# Altium schematic sheet 04_iMX 8X_PWR.SchDoc
size A3; DrawnBy: Elio F; Engineer: Elio F; Revision: A; SheetNumber: 5; SheetTotal: 22; Sheet Title: Power Unit
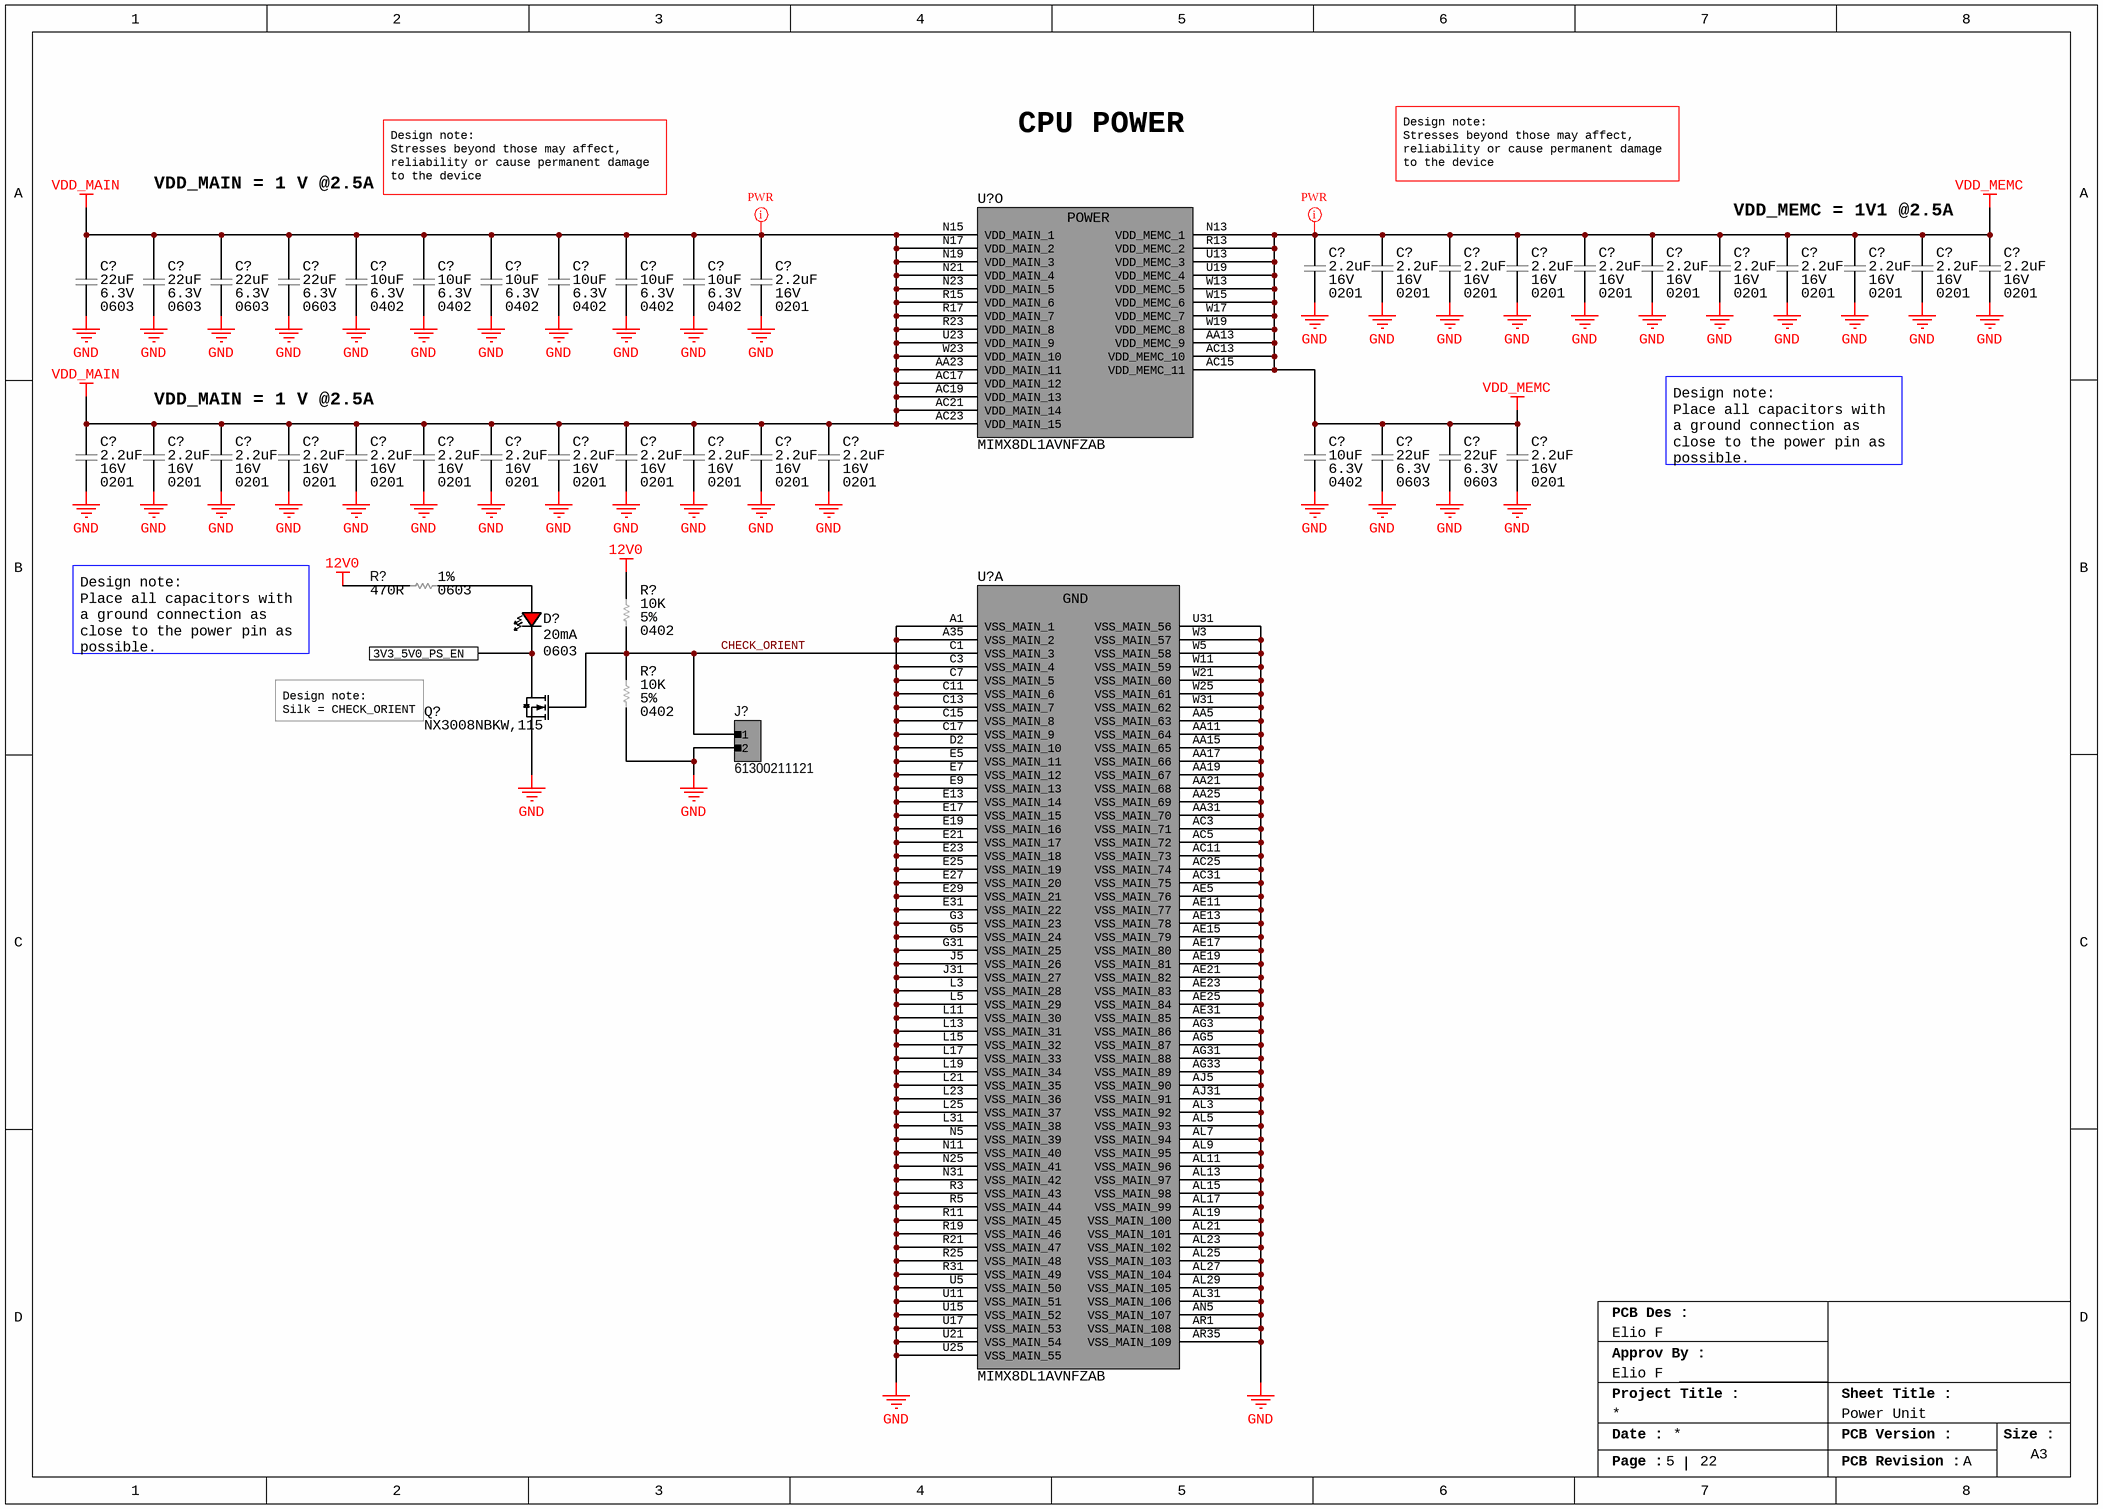
[diagram p0: 04_iMX 8X_PWR.SchDoc]

## Parts
(Parts that share a designator on the sheet are numbered #1, #2 ... from top to bottom, then left to right.)
C?#1  Capacitance: 2.2uF  Voltage Rating: 16V  Case/Package: 0201  [CAP_0201_CAPC0603X03N]  (hidden comment: GRM035R61C225ME01D)
C?#2  Capacitance: 2.2uF  Voltage Rating: 16V  Case/Package: 0201  [CAP_0201_CAPC0603X03N]  (hidden comment: GRM035R61C225ME01D)
C?#3  Capacitance: 2.2uF  Voltage Rating: 16V  Case/Package: 0201  [CAP_0201_CAPC0603X03N]  (hidden comment: GRM035R61C225ME01D)
C?#4  Capacitance: 2.2uF  Voltage Rating: 16V  Case/Package: 0201  [CAP_0201_CAPC0603X03N]  (hidden comment: GRM035R61C225ME01D)
C?#5  Capacitance: 2.2uF  Voltage Rating: 16V  Case/Package: 0201  [CAP_0201_CAPC0603X03N]  (hidden comment: GRM035R61C225ME01D)
C?#6  Capacitance: 2.2uF  Voltage Rating: 16V  Case/Package: 0201  [CAP_0201_CAPC0603X03N]  (hidden comment: GRM035R61C225ME01D)
C?#7  Capacitance: 2.2uF  Voltage Rating: 16V  Case/Package: 0201  [CAP_0201_CAPC0603X03N]  (hidden comment: GRM035R61C225ME01D)
C?#8  Capacitance: 2.2uF  Voltage Rating: 16V  Case/Package: 0201  [CAP_0201_CAPC0603X03N]  (hidden comment: GRM035R61C225ME01D)
C?#9  Capacitance: 2.2uF  Voltage Rating: 16V  Case/Package: 0201  [CAP_0201_CAPC0603X03N]  (hidden comment: GRM035R61C225ME01D)
C?#10  Capacitance: 2.2uF  Voltage Rating: 16V  Case/Package: 0201  [CAP_0201_CAPC0603X03N]  (hidden comment: GRM035R61C225ME01D)
C?#11  Capacitance: 2.2uF  Voltage Rating: 16V  Case/Package: 0201  [CAP_0201_CAPC0603X03N]  (hidden comment: GRM035R61C225ME01D)
C?#12  Voltage Rating: 6.3V  Capacitance: 22uF  Case/Package: 0603  [CAP_0603_CAPC1608X08N]  (hidden comment: GRM188R60J226MEA0D)
C?#13  Voltage Rating: 6.3V  Capacitance: 22uF  Case/Package: 0603  [CAP_0603_CAPC1608X08N]  (hidden comment: GRM188R60J226MEA0D)
C?#14  Voltage Rating: 6.3V  Capacitance: 22uF  Case/Package: 0603  [CAP_0603_CAPC1608X08N]  (hidden comment: GRM188R60J226MEA0D)
C?#15  Voltage Rating: 6.3V  Capacitance: 22uF  Case/Package: 0603  [CAP_0603_CAPC1608X08N]  (hidden comment: GRM188R60J226MEA0D)
C?#16  Case/Package: 0402  Capacitance: 10uF  Voltage Rating: 6.3V  [CAP_0402_CAPC1005X05N]  (hidden comment: CL05A106MQ5NUNC)
C?#17  Case/Package: 0402  Capacitance: 10uF  Voltage Rating: 6.3V  [CAP_0402_CAPC1005X05N]  (hidden comment: CL05A106MQ5NUNC)
C?#18  Case/Package: 0402  Capacitance: 10uF  Voltage Rating: 6.3V  [CAP_0402_CAPC1005X05N]  (hidden comment: CL05A106MQ5NUNC)
C?#19  Case/Package: 0402  Capacitance: 10uF  Voltage Rating: 6.3V  [CAP_0402_CAPC1005X05N]  (hidden comment: CL05A106MQ5NUNC)
C?#20  Case/Package: 0402  Capacitance: 10uF  Voltage Rating: 6.3V  [CAP_0402_CAPC1005X05N]  (hidden comment: CL05A106MQ5NUNC)
C?#21  Case/Package: 0402  Capacitance: 10uF  Voltage Rating: 6.3V  [CAP_0402_CAPC1005X05N]  (hidden comment: CL05A106MQ5NUNC)
C?#22  Capacitance: 2.2uF  Voltage Rating: 16V  Case/Package: 0201  [CAP_0201_CAPC0603X03N]  (hidden comment: GRM035R61C225ME01D)
C?#23  Capacitance: 2.2uF  Voltage Rating: 16V  Case/Package: 0201  [CAP_0201_CAPC0603X03N]  (hidden comment: GRM035R61C225ME01D)
C?#24  Capacitance: 2.2uF  Voltage Rating: 16V  Case/Package: 0201  [CAP_0201_CAPC0603X03N]  (hidden comment: GRM035R61C225ME01D)
C?#25  Capacitance: 2.2uF  Voltage Rating: 16V  Case/Package: 0201  [CAP_0201_CAPC0603X03N]  (hidden comment: GRM035R61C225ME01D)
C?#26  Capacitance: 2.2uF  Voltage Rating: 16V  Case/Package: 0201  [CAP_0201_CAPC0603X03N]  (hidden comment: GRM035R61C225ME01D)
C?#27  Capacitance: 2.2uF  Voltage Rating: 16V  Case/Package: 0201  [CAP_0201_CAPC0603X03N]  (hidden comment: GRM035R61C225ME01D)
C?#28  Capacitance: 2.2uF  Voltage Rating: 16V  Case/Package: 0201  [CAP_0201_CAPC0603X03N]  (hidden comment: GRM035R61C225ME01D)
C?#29  Capacitance: 2.2uF  Voltage Rating: 16V  Case/Package: 0201  [CAP_0201_CAPC0603X03N]  (hidden comment: GRM035R61C225ME01D)
C?#30  Capacitance: 2.2uF  Voltage Rating: 16V  Case/Package: 0201  [CAP_0201_CAPC0603X03N]  (hidden comment: GRM035R61C225ME01D)
C?#31  Capacitance: 2.2uF  Voltage Rating: 16V  Case/Package: 0201  [CAP_0201_CAPC0603X03N]  (hidden comment: GRM035R61C225ME01D)
C?#32  Capacitance: 2.2uF  Voltage Rating: 16V  Case/Package: 0201  [CAP_0201_CAPC0603X03N]  (hidden comment: GRM035R61C225ME01D)
C?#33  Capacitance: 2.2uF  Voltage Rating: 16V  Case/Package: 0201  [CAP_0201_CAPC0603X03N]  (hidden comment: GRM035R61C225ME01D)
C?#34  Capacitance: 2.2uF  Voltage Rating: 16V  Case/Package: 0201  [CAP_0201_CAPC0603X03N]  (hidden comment: GRM035R61C225ME01D)
C?#35  Case/Package: 0402  Capacitance: 10uF  Voltage Rating: 6.3V  [CAP_0402_CAPC1005X05N]  (hidden comment: CL05A106MQ5NUNC)
C?#36  Voltage Rating: 6.3V  Capacitance: 22uF  Case/Package: 0603  [CAP_0603_CAPC1608X08N]  (hidden comment: GRM188R60J226MEA0D)
C?#37  Voltage Rating: 6.3V  Capacitance: 22uF  Case/Package: 0603  [CAP_0603_CAPC1608X08N]  (hidden comment: GRM188R60J226MEA0D)
C?#38  Capacitance: 2.2uF  Voltage Rating: 16V  Case/Package: 0201  [CAP_0201_CAPC0603X03N]  (hidden comment: GRM035R61C225ME01D)
D?  Test Current: 20mA  Case/Package: 0603  [LED_0603-RED-0.75mm]  (hidden comment: LTST-C190KRKT)
J?  61300211121  [HEADER_MALE_HDRV2W110P0X254_1X2_508X254X854P]
Q?  NX3008NBKW,115  [TRANS_FET_SOT65P210X110-3N]
R?#1  Tolerance: 1%  Resistance: 470R  Case/Package: 0603  [RES_0603_RESC1608X04N]  (hidden comment: RC0603FR-07470RL)
R?#2  Tolerance: 5%  Resistance: 10K  Case/Package: 0402  [RES_0402_RESC1005X04N]  (hidden comment: ERJ-2GEJ103X)
R?#3  Tolerance: 5%  Resistance: 10K  Case/Package: 0402  [RES_0402_RESC1005X04N]  (hidden comment: ERJ-2GEJ103X)
U?#1  MIMX8DL1AVNFZAB  [MIMX8DL1AVNFZAB]  (part O of 15)
U?#2  MIMX8DL1AVNFZAB  [MIMX8DL1AVNFZAB]  (part A of 15)

## Ports
3V3_5V0_PS_EN

## Nets
12V0: R?#1.1 R?#2.1
GND: C?#1.1 C?#2.1 C?#3.1 C?#4.1 C?#5.1 C?#6.1 C?#7.1 C?#8.1 C?#9.1 C?#10.1 C?#11.1 C?#12.1 C?#13.1 C?#14.1 C?#15.1 C?#16.1 C?#17.1 C?#18.1 C?#19.1 C?#20.1 C?#21.1 C?#22.1 C?#23.1 C?#24.1 C?#25.1 C?#26.1 C?#27.1 C?#28.1 C?#29.1 C?#30.1 C?#31.1 C?#32.1 C?#33.1 C?#34.1 C?#35.1 C?#36.1 C?#37.1 C?#38.1 J?.2 Q?.S R?#3.2 U?#2.A1(VSS_MAIN_1) U?#2.A35(VSS_MAIN_2) U?#2.AA5(VSS_MAIN_63) U?#2.AA11(VSS_MAIN_64) U?#2.AA15(VSS_MAIN_65) U?#2.AA17(VSS_MAIN_66) U?#2.AA19(VSS_MAIN_67) U?#2.AA21(VSS_MAIN_68) U?#2.AA25(VSS_MAIN_69) U?#2.AA31(VSS_MAIN_70) U?#2.AC3(VSS_MAIN_71) U?#2.AC5(VSS_MAIN_72) U?#2.AC11(VSS_MAIN_73) U?#2.AC25(VSS_MAIN_74) U?#2.AC31(VSS_MAIN_75) U?#2.AE5(VSS_MAIN_76) U?#2.AE11(VSS_MAIN_77) U?#2.AE13(VSS_MAIN_78) U?#2.AE15(VSS_MAIN_79) U?#2.AE17(VSS_MAIN_80) U?#2.AE19(VSS_MAIN_81) U?#2.AE21(VSS_MAIN_82) U?#2.AE23(VSS_MAIN_83) U?#2.AE25(VSS_MAIN_84) U?#2.AE31(VSS_MAIN_85) U?#2.AG3(VSS_MAIN_86) U?#2.AG5(VSS_MAIN_87) U?#2.AG31(VSS_MAIN_88) U?#2.AG33(VSS_MAIN_89) U?#2.AJ5(VSS_MAIN_90) U?#2.AJ31(VSS_MAIN_91) U?#2.AL3(VSS_MAIN_92) U?#2.AL5(VSS_MAIN_93) U?#2.AL7(VSS_MAIN_94) U?#2.AL9(VSS_MAIN_95) U?#2.AL11(VSS_MAIN_96) U?#2.AL13(VSS_MAIN_97) U?#2.AL15(VSS_MAIN_98) U?#2.AL17(VSS_MAIN_99) U?#2.AL19(VSS_MAIN_100) U?#2.AL21(VSS_MAIN_101) U?#2.AL23(VSS_MAIN_102) U?#2.AL25(VSS_MAIN_103) U?#2.AL27(VSS_MAIN_104) U?#2.AL29(VSS_MAIN_105) U?#2.AL31(VSS_MAIN_106) U?#2.AN5(VSS_MAIN_107) U?#2.AR1(VSS_MAIN_108) U?#2.AR35(VSS_MAIN_109) U?#2.C3(VSS_MAIN_4) U?#2.C7(VSS_MAIN_5) U?#2.C11(VSS_MAIN_6) U?#2.C13(VSS_MAIN_7) U?#2.C15(VSS_MAIN_8) U?#2.C17(VSS_MAIN_9) U?#2.D2(VSS_MAIN_10) U?#2.E5(VSS_MAIN_11) U?#2.E7(VSS_MAIN_12) U?#2.E9(VSS_MAIN_13) U?#2.E13(VSS_MAIN_14) U?#2.E17(VSS_MAIN_15) U?#2.E19(VSS_MAIN_16) U?#2.E21(VSS_MAIN_17) U?#2.E23(VSS_MAIN_18) U?#2.E25(VSS_MAIN_19) U?#2.E27(VSS_MAIN_20) U?#2.E29(VSS_MAIN_21) U?#2.E31(VSS_MAIN_22) U?#2.G3(VSS_MAIN_23) U?#2.G5(VSS_MAIN_24) U?#2.G31(VSS_MAIN_25) U?#2.J5(VSS_MAIN_26) U?#2.J31(VSS_MAIN_27) U?#2.L3(VSS_MAIN_28) U?#2.L5(VSS_MAIN_29) U?#2.L11(VSS_MAIN_30) U?#2.L13(VSS_MAIN_31) U?#2.L15(VSS_MAIN_32) U?#2.L17(VSS_MAIN_33) U?#2.L19(VSS_MAIN_34) U?#2.L21(VSS_MAIN_35) U?#2.L23(VSS_MAIN_36) U?#2.L25(VSS_MAIN_37) U?#2.L31(VSS_MAIN_38) U?#2.N5(VSS_MAIN_39) U?#2.N11(VSS_MAIN_40) U?#2.N25(VSS_MAIN_41) U?#2.N31(VSS_MAIN_42) U?#2.R3(VSS_MAIN_43) U?#2.R5(VSS_MAIN_44) U?#2.R11(VSS_MAIN_45) U?#2.R19(VSS_MAIN_46) U?#2.R21(VSS_MAIN_47) U?#2.R25(VSS_MAIN_48) U?#2.R31(VSS_MAIN_49) U?#2.U5(VSS_MAIN_50) U?#2.U11(VSS_MAIN_51) U?#2.U15(VSS_MAIN_52) U?#2.U17(VSS_MAIN_53) U?#2.U21(VSS_MAIN_54) U?#2.U25(VSS_MAIN_55) U?#2.U31(VSS_MAIN_56) U?#2.W3(VSS_MAIN_57) U?#2.W5(VSS_MAIN_58) U?#2.W11(VSS_MAIN_59) U?#2.W21(VSS_MAIN_60) U?#2.W25(VSS_MAIN_61) U?#2.W31(VSS_MAIN_62)
VDD_MAIN: C?#12.2 C?#13.2 C?#14.2 C?#15.2 C?#16.2 C?#17.2 C?#18.2 C?#19.2 C?#20.2 C?#21.2 C?#22.2 C?#23.2 C?#24.2 C?#25.2 C?#26.2 C?#27.2 C?#28.2 C?#29.2 C?#30.2 C?#31.2 C?#32.2 C?#33.2 C?#34.2 U?#1.AA23(VDD_MAIN_11) U?#1.AC17(VDD_MAIN_12) U?#1.AC19(VDD_MAIN_13) U?#1.AC21(VDD_MAIN_14) U?#1.AC23(VDD_MAIN_15) U?#1.N15(VDD_MAIN_1) U?#1.N17(VDD_MAIN_2) U?#1.N19(VDD_MAIN_3) U?#1.N21(VDD_MAIN_4) U?#1.N23(VDD_MAIN_5) U?#1.R15(VDD_MAIN_6) U?#1.R17(VDD_MAIN_7) U?#1.R23(VDD_MAIN_8) U?#1.U23(VDD_MAIN_9) U?#1.W23(VDD_MAIN_10)
VDD_MEMC: C?#1.2 C?#2.2 C?#3.2 C?#4.2 C?#5.2 C?#6.2 C?#7.2 C?#8.2 C?#9.2 C?#10.2 C?#11.2 C?#35.2 C?#36.2 C?#37.2 C?#38.2 U?#1.AA13(VDD_MEMC_9) U?#1.AC13(VDD_MEMC_10) U?#1.AC15(VDD_MEMC_11) U?#1.N13(VDD_MEMC_1) U?#1.R13(VDD_MEMC_2) U?#1.U13(VDD_MEMC_3) U?#1.U19(VDD_MEMC_4) U?#1.W13(VDD_MEMC_5) U?#1.W15(VDD_MEMC_6) U?#1.W17(VDD_MEMC_7) U?#1.W19(VDD_MEMC_8)
3V3_5V0_PS_EN: D?.1(C) Q?.D ; port 3V3_5V0_PS_EN
CHECK_ORIENT: J?.1 Q?.G R?#2.2 R?#3.1 U?#2.C1(VSS_MAIN_3)
NetD?_2: D?.2(A) R?#1.2

## Layout directives
net class PWR: VDD_MAIN, VDD_MEMC

## Notes on the sheet
- CPU POWER
- Design note:
  Stresses beyond those may affect, reliability or cause permanent damage to the device
- VDD_MAIN = 1 V @2.5A
- (near C?#8) VDD_MEMC = 1V1 @2.5A
- (near C?#24) VDD_MAIN = 1 V @2.5A
- Design note:
  Place all capacitors with a ground connection as close to the power pin as possible.
- Design note:
  Silk = CHECK_ORIENT
- PCB Des :
- Approv By :
- Project Title :
- Sheet Title :
- Date :
- PCB Version :
- Size :
- A3
- Page :
- PCB Revision :
- (in symbol IC_MPU_ARM_1.2GHz_MIMX8DL1AVNFZAB, part A) GND
- (in symbol IC_MPU_ARM_1.2GHz_MIMX8DL1AVNFZAB, part O) POWER

## Library data of the parts
C?#1-C?#11 C?#22-C?#34 C?#38 = CAP_2.2uF_16V_X5R_0201: General Up to 85C Reflow soldering; Manufacturer: Murata; Material: Ceramic; Dielectric: X5R; Tolerance: 20%; Supplier 1: Digikey; Manufacturer Part Number: GRM035R61C225ME01D; RoHS: No; Category: Ceramic Capacitors; Stock 1: 18674; Pricing 1: 1=0.36, 10=0.233, 50=0.1636, 100=0.1321, 500=0.09814, 1000=0.08587, 2500=0.08178, 5000=0.07565 (USD); Min Operating Temperature: -55°C; Max Operating Temperature: 85°C; Voltage Rating (DC): 16V; Length: 600um; Width: 300um; Height: 550um; Thickness: 500um; RoHS Compliant: Yes; ComponentLink1URL: https://datasheet.octopart.com/GRM035R61C225ME01D-Murata-datasheet-165579666.pdf?src-supplier=TME; ComponentLink1Description: https://datasheet.octopart.com/GRM035R61C225ME01D-Murata-datasheet-165579666.pdf?src-supplier=TME; Supplier Part Number 1: 490-GRM035R61C225ME01DCT-ND
C?#12-C?#15 C?#36 C?#37 = CAP_22uF_6.3V_X5R_0603: Multilayer Ceramic Capacitor, 22 uF, 6.3 V, ï¿½ 20%, X5R, 0603 [1608 Metric]; Manufacturer: Murata; Supplier 1: Digikey; Manufacturer Part Number: GRM188R60J226MEA0D; RoHS: Yes; Category: Ceramic Capacitors; Stock 1: 4736669; Pricing 1: 1=0.2, 10=0.113, 50=0.0794, 100=0.069, 500=0.05144, 1000=0.04599 (USD); Mount: Surface Mount; Number of Pins: 2; Case Code (Metric): 1608; Case Code (Imperial): 0603; Weight: 0.000222oz; Material: Ceramic; Min Operating Temperature: -55°C; Max Operating Temperature: 85°C; Packaging: Tape and Reel; Package Quantity: 1; Series: GRM; Tolerance: 20%; Dielectric: X5R; Termination: SMD/SMT; Voltage Rating (DC): 6.3V; Length: 0.063inch; Width: 0.031inch; Height: 0.8mm; Thickness: 0.039inch; Lead Free: Lead Free; RoHS Compliant: Yes; Reach SVHC Compliant: No; ComponentLink1URL: https://datasheet.ciiva.com/29540/partnumbering-e-01-29540441.pdf?src-supplier=Digikey; ComponentLink1Description: https://datasheet.ciiva.com/29540/partnumbering-e-01-29540441.pdf?src-supplier=Digikey; ComponentLink2URL: https://datasheet.ciiva.com/29540/partnumbering-e-01-29540442.pdf?src-supplier=Digikey; ComponentLink2Description: https://datasheet.ciiva.com/29540/partnumbering-e-01-29540442.pdf?src-supplier=Digikey; ComponentLink3URL: https://datasheet.ciiva.com/29540/partnumbering-e-01-29540443.pdf?src-supplier=Digikey; ComponentLink3Description: https://datasheet.ciiva.com/29540/partnumbering-e-01-29540443.pdf?src-supplier=Digikey; Supplier Part Number 1: 490-7611-1-ND
C?#16-C?#21 C?#35 = CAP_10UF_6.3V_X5R_0402: Cap Ceramic 10uF 6.3V X5R 20% SMD 0402 85C T/R; Manufacturer: Samsung; Supplier 1: Digikey; Manufacturer Part Number: CL05A106MQ5NUNC; RoHS: Yes; Category: Ceramic Capacitors; Stock 1: 6097180; Pricing 1: 1=0.24, 10=0.153, 50=0.0968, 100=0.0774, 500=0.05588, 1000=0.04943, 2500=0.04728, 5000=0.04299 (USD); Mount: Surface Mount; Case Code (Metric): 1005; Case Code (Imperial): 0402; Min Operating Temperature: -55°C; Max Operating Temperature: 85°C; Packaging: Tape and Reel; Tolerance: 20%; Dielectric: X5R; Series: CL; Package Quantity: 1; Construction: Flat; Length: 1mm; Width: 0.02inch; Height: 0.5mm; Depth: 0.5mm; Thickness: 0.028inch; Radiation Hardening: No; RoHS Compliant: Yes; ComponentLink1URL: https://datasheet.ciiva.com/16437/cl05a106mq5nunc-16437356.pdf?src-supplier=Future+Electronics; ComponentLink1Description: https://datasheet.ciiva.com/16437/cl05a106mq5nunc-16437356.pdf?src-supplier=Future+Electronics; ComponentLink2URL: https://datasheet.ciiva.com/26877/getdatasheetpartid-355289-26877841.pdf?src-supplier=Verical; ComponentLink2Description: https://datasheet.ciiva.com/26877/getdatasheetpartid-355289-26877841.pdf?src-supplier=Verical; Supplier Part Number 1: 1276-1451-1-ND
D? = LED_DIO_RED_20mA_0603: LED,  LTST-C190KRKT; Manufacturer: Vishay Lite-On; Color: Red; Lens Color: Colorless; Luminous Intensity: 54mcd; Viewing Angle: 130°; Lens Style: Diffused,Colorless,Clear,Rectangular; Power Rating: 75mW; Dominant Wavelength: 631nm; Lens Transparency: Clear; Number of Elements: 1; Wavelength: 639nm; Reverse Voltage: 5V; Forward Current: 30mA; Forward Voltage: 2.4V; Manufacturer Part Number: LTST-C190KRKT; RoHS: Yes; Category: LEDs; Stock 1: 712361; Pricing 1: 1=0.24000, 10=0.13200, 100=0.06110, 500=0.05640, 1000=0.04418, 2000=0.04324 (USD); Mount: Surface Mount; Number of Pins: 2; Case Code (Metric): 1608; Case Code (Imperial): 0603; Min Operating Temperature: -55°C; Max Operating Temperature: 85°C; Packaging: Tape and Reel; Package Quantity: 1; Illumination Color: Red; Power Dissipation: 75mW; Number of LEDs: 1; Length: 1.6mm; Width: 0.8mm; Height: 0.8mm; Depth: 0.8mm; Radiation Hardening: No; Lead Free: Lead Free; RoHS Compliant: Yes; ComponentLink1URL: https://datasheet.ciiva.com/19482/1260381-19482354.pdf?src-supplier=Jameco; ComponentLink1Description: https://datasheet.ciiva.com/19482/1260381-19482354.pdf?src-supplier=Jameco; ComponentLink2URL: https://datasheet.ciiva.com/12403/100-ltst-c190krkt-59805-12403895.pdf?src-supplier=Mouser; ComponentLink2Description: https://datasheet.ciiva.com/12403/100-ltst-c190krkt-59805-12403895.pdf?src-supplier=Mouser; ComponentLink3URL: https://datasheet.ciiva.com/16427/ltst-c190krkt-16427674.pdf?src-supplier=Future+Electronics; ComponentLink3Description: https://datasheet.ciiva.com/16427/ltst-c190krkt-16427674.pdf?src-supplier=Future+Electronics; ComponentLink4URL: https://datasheet.ciiva.com/15117/getdatasheetpartid-57395-15117240.pdf?src-supplier=Verical; ComponentLink4Description: https://datasheet.ciiva.com/15117/getdatasheetpartid-57395-15117240.pdf?src-supplier=Verical; ComponentLink5URL: https://datasheet.ciiva.com/11774/0900766b80dc02a9-11774043.pdf?src-supplier=Rs; ComponentLink5Description: https://datasheet.ciiva.com/11774/0900766b80dc02a9-11774043.pdf?src-supplier=Rs; ComponentLink6URL: https://datasheet.ciiva.com/2109/s-110-ltst-c190krkt-2109992.pdf?src-supplier=Digi-Key; ComponentLink6Description: https://datasheet.ciiva.com/2109/s-110-ltst-c190krkt-2109992.pdf?src-supplier=Digi-Key; ComponentLink7URL: https://datasheet.ciiva.com/2109/s-110-ltst-c190krkt-2109991.pdf?src-supplier=Digi-Key; ComponentLink7Description: https://datasheet.ciiva.com/2109/s-110-ltst-c190krkt-2109991.pdf?src-supplier=Digi-Key; ComponentLink8URL: https://datasheet.ciiva.com/2109/s-110-ltst-c190krkt-2109993.pdf?src-supplier=Digi-Key; ComponentLink8Description: https://datasheet.ciiva.com/2109/s-110-ltst-c190krkt-2109993.pdf?src-supplier=Digi-Key; ComponentLink9URL: https://datasheet.ciiva.com/26937/getdatasheetpartid-631582-26937958.pdf?src-supplier=Verical; ComponentLink9Description: https://datasheet.ciiva.com/26937/getdatasheetpartid-631582-26937958.pdf?src-supplier=Verical; Supplier 1: Digi-Key; Supplier 2: Mouser; Supplier 3: Arrow Electronics; Supplier Part Number 1: 160-1436-6-ND; Supplier Part Number 2: 859-LTST-C190KRKT; Supplier Part Number 3: LTST-C190KRKT
J? = CONN_HEADER_MALE_2P_2.54_61300211121: THT Vertical Pin Header WR-PHD, Pitch 2.54 mm, Single Row, 2 pins; Manufacturer: Wurth Electronics; Current Rating: 3A; Voltage Rating: 250V; Number of Positions: 2; Gender: 29Gender; Contact Resistance: 20mR; Pitch: 0.1inch; Supplier 1: Digikey; Manufacturer Part Number: 61300211121; RoHS: Yes; Category: Headers and Wire Housings; Stock 1: 91042; Pricing 1: 1=0.13, 10=0.113, 25=0.094, 50=0.079, 100=0.071, 1000=0.065 (USD); Mount: Through Hole; Contact Plating: Gold; Housing Material: PBT; Contact Material: Copper Alloy,Copper; Color: Black; Min Operating Temperature: -40°C; Max Operating Temperature: 125°C; Number of Rows: 1; Contact Gender: Male; Packaging: Bulk; Termination: Through Hole; Number of Contacts: 2; Series: WR-PHD; Contact Type: Male Pin; Operating Supply Voltage: 250V; Orientation: Vertical; Height: 8.94mm; Contact Mating Length: 0.236inch; Lead Free: Lead Free; RoHS Compliant: Yes; Reach SVHC Compliant: Unknown; ComponentLink1URL: https://datasheet.ciiva.com/13619/6130xx11121-48870-13619345.pdf?src-supplier=Mouser; ComponentLink1Description: https://datasheet.ciiva.com/13619/6130xx11121-48870-13619345.pdf?src-supplier=Mouser; Supplier Part Number 1: 732-5315-ND
Q? = TRANS_FET_CH_N_NX3008NBKW,115: Trans MOSFET N-CH 30V 0.35A Automotive 3-Pin SC-70 T/R; Manufacturer: Nexperia; Rise Time: 11ns; Turn-Off Delay Time: 69ns; Turn-On Delay Time: 15ns; Supplier 1: Digikey; Manufacturer Part Number: NX3008NBKW,115; RoHS: Yes; Category: MOSFETs; Stock 1: 784274; Pricing 1: 1=0.35, 10=0.239, 100=0.1169, 500=0.09748, 1000=0.06774 (USD); RoHS Compliant: Yes; ComponentLink1URL: https://www.mouser.com/ds/2/302/NX3008NBKW-1151440.pdf?src-supplier=Mouser; ComponentLink1Description: https://www.mouser.com/ds/2/302/NX3008NBKW-1151440.pdf?src-supplier=Mouser; ComponentLink2URL: http://www.farnell.com/datasheets/1508392.pdf?src-supplier=Farnell; ComponentLink2Description: http://www.farnell.com/datasheets/1508392.pdf?src-supplier=Farnell; ComponentLink3URL: https://assets.nexperia.com/documents/data-sheet/NX3008NBKW.pdf?src-supplier=Digikey; ComponentLink3Description: https://assets.nexperia.com/documents/data-sheet/NX3008NBKW.pdf?src-supplier=Digikey; ComponentLink4URL: https://datasheet.octopart.com/NX3008NBKW%2C115-Nexperia-datasheet-87581391.pdf?src-supplier=LKR; ComponentLink4Description: https://datasheet.octopart.com/NX3008NBKW%2C115-Nexperia-datasheet-87581391.pdf?src-supplier=LKR; ComponentLink5URL: https://datasheet.octopart.com/NX3008NBKW%2C115-Nexperia-datasheet-154583516.pdf?src-supplier=TME; ComponentLink5Description: https://datasheet.octopart.com/NX3008NBKW%2C115-Nexperia-datasheet-154583516.pdf?src-supplier=TME; Supplier Part Number 1: 1727-1280-1-ND
R?#1 = RES_470R_1%_100mW_0603: SMD Chip Resistor, 470 Ohm, ± 1%, 100 mW, 0603 [1608 Metric], Thick Film, General Purpose; Manufacturer: Yageo; Power Rating: 100mW; Voltage Rating: 50V; Temperature Coefficient: 100ppm/°C; Working Voltage: 75V; Impedance: 50R; Supplier 1: Digikey; Manufacturer Part Number: RC0603FR-07470RL; RoHS: Yes; Category: Chip SMD Resistors; Stock 1: 395293; Pricing 1: 1=0.1, 10=0.019, 50=0.0112, 100=0.0093, 500=0.00622, 1000=0.00532 (USD); Case Code (Metric): 1608; Case Code (Imperial): 0603; Contact Material: 152ConductorMaterial; Contact Plating: 157ConductorMaterial; Min Operating Temperature: -55°C; Max Operating Temperature: 155°C; Packaging: Tape and Reel; Package Quantity: 1; Resistor Type: Thick Film; Number of Terminations: 2; Termination: SMD/SMT; Max Power Dissipation: 100mW; Features: Moisture Resistant; Series: RC; Technology: THICK FILM; Resistance Tolerance: 1%; Length: 0.063inch; Width: 0.031inch; Height: 0.022inch; Depth: 0.8mm; Radiation Hardening: 5898YesNo; RoHS Compliant: Yes; Reach SVHC Compliant: No; Lead Free: Lead Free; ComponentLink1URL: https://datasheet.ciiva.com/11808/0900766b80f96399-11808177.pdf?src-supplier=Rs; ComponentLink1Description: https://datasheet.ciiva.com/11808/0900766b80f96399-11808177.pdf?src-supplier=Rs; ComponentLink2URL: https://datasheet.ciiva.com/7660/1868787-7660793.pdf?src-supplier=Element14; ComponentLink2Description: https://datasheet.ciiva.com/7660/1868787-7660793.pdf?src-supplier=Element14; ComponentLink3URL: https://datasheet.ciiva.com/46440/1868787-46440907.pdf?src-supplier=Element14; ComponentLink3Description: https://datasheet.ciiva.com/46440/1868787-46440907.pdf?src-supplier=Element14; ComponentLink4URL: https://datasheet.ciiva.com/2454/pyu-r-int-thick-7-2454013.pdf?src-supplier=Digikey; ComponentLink4Description: https://datasheet.ciiva.com/2454/pyu-r-int-thick-7-2454013.pdf?src-supplier=Digikey; ComponentLink5URL: https://datasheet.ciiva.com/2454/pyu-r-int-thick-7-2454014.pdf?src-supplier=Digikey; ComponentLink5Description: https://datasheet.ciiva.com/2454/pyu-r-int-thick-7-2454014.pdf?src-supplier=Digikey; ComponentLink6URL: https://datasheet.ciiva.com/2454/pyu-r-int-thick-7-2454012.pdf?src-supplier=Digikey; ComponentLink6Description: https://datasheet.ciiva.com/2454/pyu-r-int-thick-7-2454012.pdf?src-supplier=Digikey; ComponentLink7URL: https://datasheet.ciiva.com/7746/1738695-7746359.pdf?src-supplier=Element14; ComponentLink7Description: https://datasheet.ciiva.com/7746/1738695-7746359.pdf?src-supplier=Element14; ComponentLink8URL: https://datasheet.ciiva.com/7746/1738695-7746360.pdf?src-supplier=Element14; ComponentLink8Description: https://datasheet.ciiva.com/7746/1738695-7746360.pdf?src-supplier=Element14; Supplier Part Number 1: 311-470HRCT-ND
R?#2 R?#3 = RES_10K_5%_100mW_0402: Res Thick Film 0402 10K Ohm 5% 1/10W ±200ppm/°C Molded SMD Punched Carrier T/R; Manufacturer: Panasonic; Power Rating: 100mW; Voltage Rating: 50V; Supplier 1: Digi-Key; Manufacturer Part Number: ERJ-2GEJ103X; RoHS: Yes; Category: Chip SMD Resistors; Stock 1: 4696986; Pricing 1: 1=0.1, 10=0.021, 50=0.0132, 100=0.011, 500=0.00744, 1000=0.00639, 5000=0.00464 (USD); Mount: Surface Mount; Contact Plating: Tin; Case Code (Metric): 1005; Case Code (Imperial): 0402; Size Code: 0402; Min Operating Temperature: -55°C; Max Operating Temperature: 155°C; Temperature Coefficient: 200ppm/°C; Packaging: Cut Tape; Resistor Type: Thick Film; Package Quantity: 10000; Number of Terminations: 2; Termination: SMD/SMT; Max Power Dissipation: 100mW; Features: Automotive AEC-Q200; Series: ERJ; Resistance Tolerance: 5%; Technology: THICK FILM; Voltage Rating (DC): 50V; Length: 1mm; Width: 0.5mm; Height: 0.35mm; Depth: 0.5mm; Ratings: AEC-Q200; Radiation Hardening: No; Reach SVHC Compliant: No; RoHS Compliant: Yes; Lead Free: 5697LeadFree; ComponentLink1URL: https://datasheet.ciiva.com/27055/1935721-27055112.pdf?src-supplier=Jameco; ComponentLink1Description: https://datasheet.ciiva.com/27055/1935721-27055112.pdf?src-supplier=Jameco; ComponentLink2URL: https://datasheet.ciiva.com/11821/0900766b80f806dd-11821170.pdf?src-supplier=Rs; ComponentLink2Description: https://datasheet.ciiva.com/11821/0900766b80f806dd-11821170.pdf?src-supplier=Rs; ComponentLink3URL: https://datasheet.ciiva.com/43460/1678796-43460391.pdf?src-supplier=Farnell; ComponentLink3Description: https://datasheet.ciiva.com/43460/1678796-43460391.pdf?src-supplier=Farnell; ComponentLink4URL: https://datasheet.ciiva.com/22785/1678796-22785949.pdf?src-supplier=Farnell; ComponentLink4Description: https://datasheet.ciiva.com/22785/1678796-22785949.pdf?src-supplier=Farnell; ComponentLink5URL: https://datasheet.ciiva.com/46371/1678796-46371910.pdf?src-supplier=Element14; ComponentLink5Description: https://datasheet.ciiva.com/46371/1678796-46371910.pdf?src-supplier=Element14; ComponentLink6URL: https://datasheet.ciiva.com/28514/1678796-28514154.pdf?src-supplier=Element14; ComponentLink6Description: https://datasheet.ciiva.com/28514/1678796-28514154.pdf?src-supplier=Element14; ComponentLink7URL: https://datasheet.ciiva.com/24070/aoa0000ce1-37422-24070679.pdf?src-supplier=Mouser; ComponentLink7Description: https://datasheet.ciiva.com/24070/aoa0000ce1-37422-24070679.pdf?src-supplier=Mouser; ComponentLink8URL: https://datasheet.ciiva.com/16767/70260739-16767130.pdf?src-supplier=Allied+Electronics; ComponentLink8Description: https://datasheet.ciiva.com/16767/70260739-16767130.pdf?src-supplier=Allied+Electronics; ComponentLink9URL: https://datasheet.ciiva.com/16774/70260739-16774504.pdf?src-supplier=Allied+Electronics; ComponentLink9Description: https://datasheet.ciiva.com/16774/70260739-16774504.pdf?src-supplier=Allied+Electronics; ComponentLink10URL: https://datasheet.ciiva.com/9194/aoa0000ce1-9194140.pdf?src-supplier=Avnet; ComponentLink10Description: https://datasheet.ciiva.com/9194/aoa0000ce1-9194140.pdf?src-supplier=Avnet; Supplier Part Number 1: P10KJCT-ND
U?#1 U?#2 = IC_MPU_ARM_1.2GHz_MIMX8DL1AVNFZAB: I.MX8 Dxl 15SQ / Tray Rohs Compliant: Yes; Manufacturer: NXP Semiconductors; Supplier 1: Mouser; Manufacturer Part Number: MIMX8DL1AVNFZAB; RoHS: No; Category: Uncategorized; Stock 1: 196; Pricing 1: 1=46.19, 10=40.26, 25=38.57, 50=38.56, 100=33.3, 252=33.16, 1000=33.3, 10000=33.3 (USD); Supplier Part Number 1: 771-MIMX8DL1AVNFZAB